# Altium schematic sheet TC58BVG1S3HBAI4.SchDoc
size A4; SheetNumber: 11; SheetTotal: 11
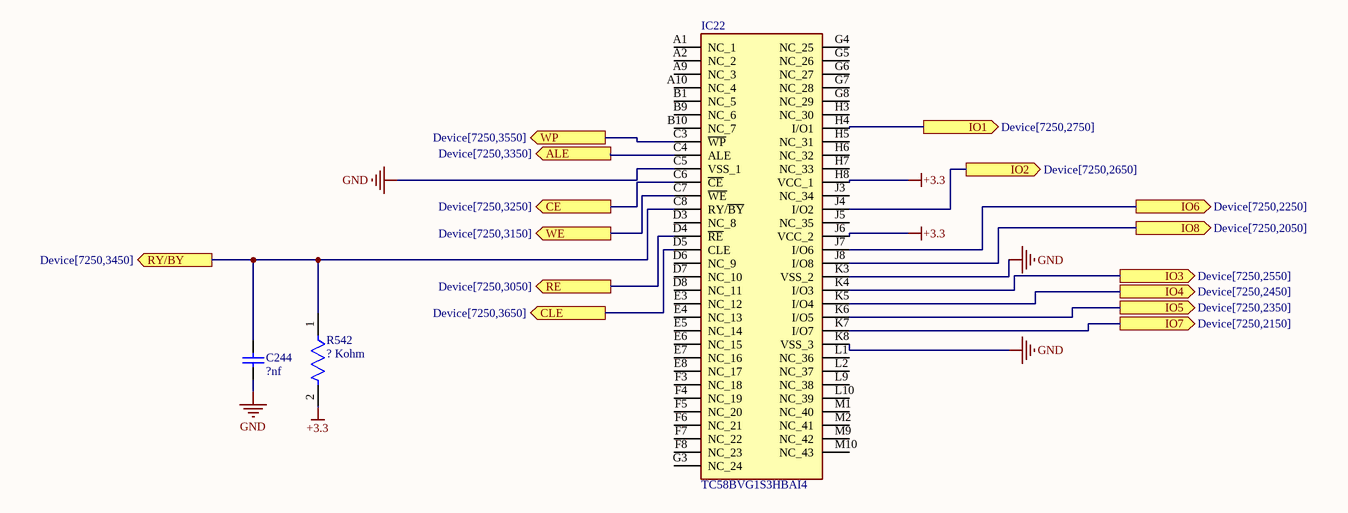
[diagram p0: TC58BVG1S3HBAI4.SchDoc]

## Parts
C244  ?nf  [CAPC1005X55X25NL05T10]
IC22  TC58BVG1S3HBAI4  [BGA63C80P10X12_900X1100X100]
R542  ? Kohm  [FP-RC1005-IPC_C]

## Ports
ALE (out, see Device[7250,3350]), CE (out, see Device[7250,3250]), CLE (out, see Device[7250,3650]), IO1 (out, see Device[7250,2750]), IO2 (out, see Device[7250,2650]), IO3 (out, see Device[7250,2550]), IO4 (out, see Device[7250,2450]), IO5 (out, see Device[7250,2350]), IO6 (out, see Device[7250,2250]), IO7 (out, see Device[7250,2150]), IO8 (out, see Device[7250,2050]), RE (out, see Device[7250,3050]), RY/BY (out, see Device[7250,3450]), WE (out, see Device[7250,3150]), WP (out, see Device[7250,3550])

## Nets
+3.3: IC22.H8(VCC_1) IC22.J6(VCC_2) R542.2
GND: C244.1 IC22.C5(VSS_1) IC22.K3(VSS_2) IC22.K8(VSS_3)
ALE: IC22.C4(ALE) ; port ALE
CE: IC22.C6(~{CE}) ; port CE
CLE: IC22.D5(CLE) ; port CLE
IO1: IC22.H4(I/O1) ; port IO1
IO2: IC22.J4(I/O2) ; port IO2
IO3: IC22.K4(I/O3) ; port IO3
IO4: IC22.K5(I/O4) ; port IO4
IO5: IC22.K6(I/O5) ; port IO5
IO6: IC22.J7(I/O6) ; port IO6
IO7: IC22.K7(I/O7) ; port IO7
IO8: IC22.J8(I/O8) ; port IO8
RE: IC22.D4(~{RE}) ; port RE
RY/BY: C244.2 IC22.C8(RY/~{BY}) R542.1 ; port RY/BY
WE: IC22.C7(~{WE}) ; port WE
WP: IC22.C3(~{WP}) ; port WP

Not connected (* = marked no-connect by the designer): IC22 A1(NC_1) A2(NC_2) A9(NC_3) A10(NC_4) B1(NC_5) B9(NC_6) B10(NC_7) D3(NC_8) D6(NC_9) D7(NC_10) D8(NC_11) E3(NC_12) E4(NC_13) E5(NC_14) E6(NC_15) E7(NC_16) E8(NC_17) F3(NC_18) F4(NC_19) F5(NC_20) F6(NC_21) F7(NC_22) F8(NC_23) G3(NC_24) G4(NC_25) G5(NC_26) G6(NC_27) G7(NC_28) G8(NC_29) H3(NC_30) H5(NC_31) H6(NC_32) H7(NC_33) J3(NC_34) J5(NC_35) L1(NC_36) L2(NC_37) L9(NC_38) L10(NC_39) M1(NC_40) M2(NC_41) M9(NC_42) M10(NC_43)

## Library data of the parts
C244 = CMP-2008-04515-1: Manufacturer: Murata; Part Number: GRM155F50J684ZE01D
IC22 = TC58BVG1S3HBAI4: Integrated Circuit; Manufacturer_Name: Toshiba; Datasheet Link: https://media.digikey.com/pdf/Data%20Sheets/Toshiba%20PDFs/KIOXIA_TC58BVG1S3HBAI4_REV2.00_E20191001C.pdf; Height: 1mm; Manufacturer_Part_Number: TC58BVG1S3HBAI4; Mouser Part Number: 757-TC58BVG1S3HBAI4; Mouser Price/Stock: https://www.mouser.com/Search/Refine.aspx?Keyword=757-TC58BVG1S3HBAI4
R542 = CMP-13261-000953-1: Res Thick Film 0402 1.87kΩ 1% 0.063W ±100ppm/°C Molded SMD T/R; Power Rating: 63mW; Voltage Rating (DC): 50V; Resistance: 1.87kR; Tolerance: 1%; Height: 0.016inch; Length: 1mm; Case Code (Metric): 1005; Width: 0.02inch; Max Power Dissipation: 63mW; Radiation Hardening: No; Features: Moisture Resistant; Temperature Coefficient: 100ppm/°C; Min Operating Temperature: -55°C; Number of Terminations: 2; Max Operating Temperature: 155°C; Case Code (Imperial): 0402; Composition: Thick Film; Depth: 0.5mm; Lead Free: Lead Free; Package Quantity: 1; Case/Package: 0402; Packaging: Tape and Reel; Contact Plating: Tin; Military Standard: Not